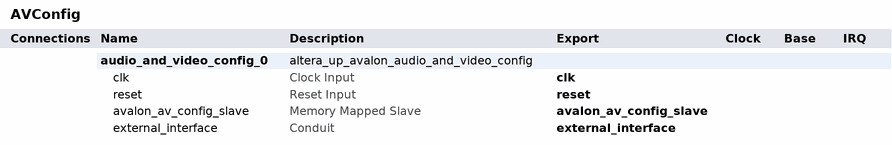
[diagram p0: system contents]
# Platform Designer (Qsys) system AVConfig, Cyclone V 5CSEMA5F31C6
# Parameters at their usual value, and those the tool derives, are not listed.
package require -exact qsys 18.0
create_system AVConfig
set_project_property DEVICE_FAMILY {Cyclone V}
set_project_property DEVICE 5CSEMA5F31C6

add_instance audio_and_video_config_0 altera_up_avalon_audio_and_video_config 18.0
set_instance_property audio_and_video_config_0 AUTO_EXPORT true
set_instance_parameter_value audio_and_video_config_0 audio_in {Line In to ADC}
set_instance_parameter_value audio_and_video_config_0 bit_length 16
set_instance_parameter_value audio_and_video_config_0 board DE1-SoC
set_instance_parameter_value audio_and_video_config_0 line_in_bypass false
set_instance_parameter_value audio_and_video_config_0 sampling_rate {48 kHz}

# exported interfaces
add_interface avalon_av_config_slave avalon slave
set_interface_property avalon_av_config_slave EXPORT_OF audio_and_video_config_0.avalon_av_config_slave
add_interface clk clock sink
set_interface_property clk EXPORT_OF audio_and_video_config_0.clk
add_interface external_interface conduit end
set_interface_property external_interface EXPORT_OF audio_and_video_config_0.external_interface
add_interface reset reset sink
set_interface_property reset EXPORT_OF audio_and_video_config_0.reset

set_interconnect_requirement {$system} qsys_mm.clockCrossingAdapter HANDSHAKE
set_interconnect_requirement {$system} qsys_mm.enableEccProtection FALSE
set_interconnect_requirement {$system} qsys_mm.insertDefaultSlave FALSE
set_interconnect_requirement {$system} qsys_mm.maxAdditionalLatency 1

save_system AVConfig.qsys
